# EAGLE design Main (EAGLE 7.2.0)
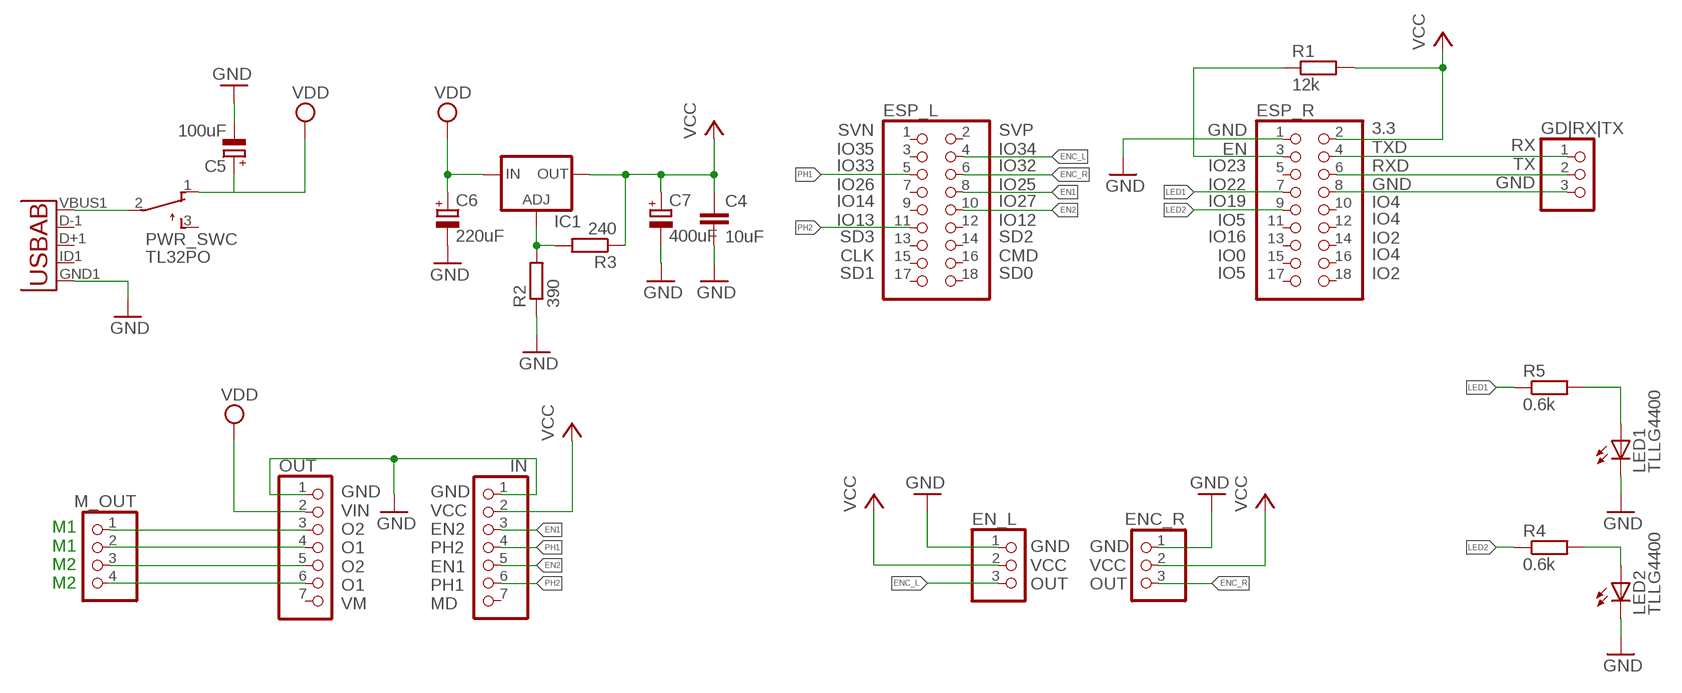
[diagram p0: schematic, sheet 1]

## Parts
C4  10uF  C-EU050-025X075  [C050-025X075]
C5  100uF  CPOL-EUE2.5-6  [E2,5-6]
C6  220uF  CPOL-EUE2.5-6  [E2,5-6]
C7  400uF  CPOL-EUE2.5-6  [E2,5-6]
EN_L  PINHD-1X3  [1X03]
ENC_R  PINHD-1X3  [1X03]
ESP_L  PINHD-2X9  [2X09]
ESP_R  PINHD-2X9  [2X09]
GD|RX|TX  PINHD-1X3  [1X03]
IC1  LM317TS  [317TS]
IN  PINHD-1X7  [1X07]
LED1  TLLG4400  [LED3MM]
LED2  TLLG4400  [LED3MM]
M_OUT  PINHD-1X4  [1X04]
OUT  PINHD-1X7  [1X07]
PWR_SWC  TL32PO  [TL3XPO]
R1  12k  R-EU_0207/10  [0207/10]
R2  390  R-EU_0207/10  [0207/10]
R3  240  R-EU_0207/10  [0207/10]
R4  0.6k  R-EU_0207/10  [0207/10]
R5  0.6k  R-EU_0207/10  [0207/10]
U3  USB""  [USB-MICRO-SMD]

## Nets
EN1: ESP_L.8 IN.3
EN2: ESP_L.10 IN.5
ENC_L: EN_L.3 ESP_L.4
ENC_R: ENC_R.3 ESP_L.6
GND: C4.2 C5.- C6.- C7.- EN_L.1 ENC_R.1 ESP_R.1 IN.1 LED1.K(C) LED2.K(C) OUT.1 R2.1 U3.GND1(GND)
LED1: ESP_R.7 R5.1
LED2: ESP_R.9 R4.1
N$1: M_OUT.1 OUT.3
N$2: M_OUT.2 OUT.4
N$3: M_OUT.3 OUT.5
N$4: M_OUT.4 OUT.6
N$5: ESP_R.4 GD|RX|TX.1
N$6: ESP_R.6 GD|RX|TX.2
N$7: IC1.1(ADJ) R2.2 R3.2
N$8: ESP_R.8 GD|RX|TX.3
N$10: LED2.A R4.2
N$11: PWR_SWC.2(P) U3.VBUS1(VBUS)
N$12: ESP_R.3 R1.1
N$13: LED1.A R5.2
PH1: ESP_L.5 IN.4
PH2: ESP_L.11 IN.6
VCC: C4.1 C7.+ EN_L.2 ENC_R.2 ESP_R.2 IC1.2(OUT) IN.2 R1.2 R3.1
VDD: C5.+ C6.+ IC1.3(IN) OUT.2 PWR_SWC.1(O)
Unconnected: ESP_L.1 ESP_L.2 ESP_L.3 ESP_L.7 ESP_L.9 ESP_L.12 ESP_L.13 ESP_L.14 ESP_L.15 ESP_L.16 ESP_L.17 ESP_L.18 ESP_R.5 ESP_R.10 ESP_R.11 ESP_R.12 ESP_R.13 ESP_R.14 ESP_R.15 ESP_R.16 ESP_R.17 ESP_R.18 IN.7 OUT.7 PWR_SWC.3(S) U3.D+1(D+) U3.D-1(D-) U3.ID1(USBID)

## Notes on the sheet
- SVN
  IO35
- SVP
  IO34
- GND
  EN
- RX
  TX
  GND
- IO33
  IO26
- IO32
  IO25
- IO23
  IO22
- 3.3
  TXD
  RXD
  GND
- IO4
- IO14
  IO13
- IO27
  IO12
- IO19
  IO5
- IO4
  IO2
- SD3
  CLK
- SD2
  CMD
- IO16
  IO0
- SD1 | SD0 | IO5
- IO4
  IO2
- M1
  M1
  M2
  M2
- GND
  VCC
  OUT
- GND
  VCC
  OUT
- GND
  VIN
  O2
  O1
  O2
  O1
  VM
- GND
  VCC
  EN2
  PH2
  EN1
  PH1
  MD

## Library data of the parts
C4 = resistor:C-EU: CAPACITOR, European symbol
C5-C7 = rcl:CPOL-EU: POLARIZED CAPACITOR, European symbol
EN_L ENC_R GD|RX|TX = pinhead:PINHD-1X3: PIN HEADER
ESP_L ESP_R = pinhead:PINHD-2X9: PIN HEADER
IC1 = v-reg:LM317TS: VOLTAGE REGULATOR
IN OUT = pinhead:PINHD-1X7: PIN HEADER
LED1 LED2 = led:TLLG4400: Low Current (2mA) LED 3 mm Tinted Diffused Package color GREEN Source: Data sheet <http://www.farnell.com/datasheets/391098.pdf>; MF: VISHAY SEMICONDUCTOR; OC_FARNELL: 1612435
M_OUT = pinhead:PINHD-1X4: PIN HEADER
PWR_SWC = switch:TL32PO: TINY SWITCH ON - MOM Source: http://www2.produktinfo.conrad.com/datenblaetter/700000-724999/705152-da-01-de-Subminiaturschalter_TL_36YO.pdf
R1-R5 = rcl:R-EU_: RESISTOR, European symbol
U3 = MicroUSB:USB: This is a USB AB connector that is compatible with USB OTG. i.e. this connector can serve as a host or device

## Board
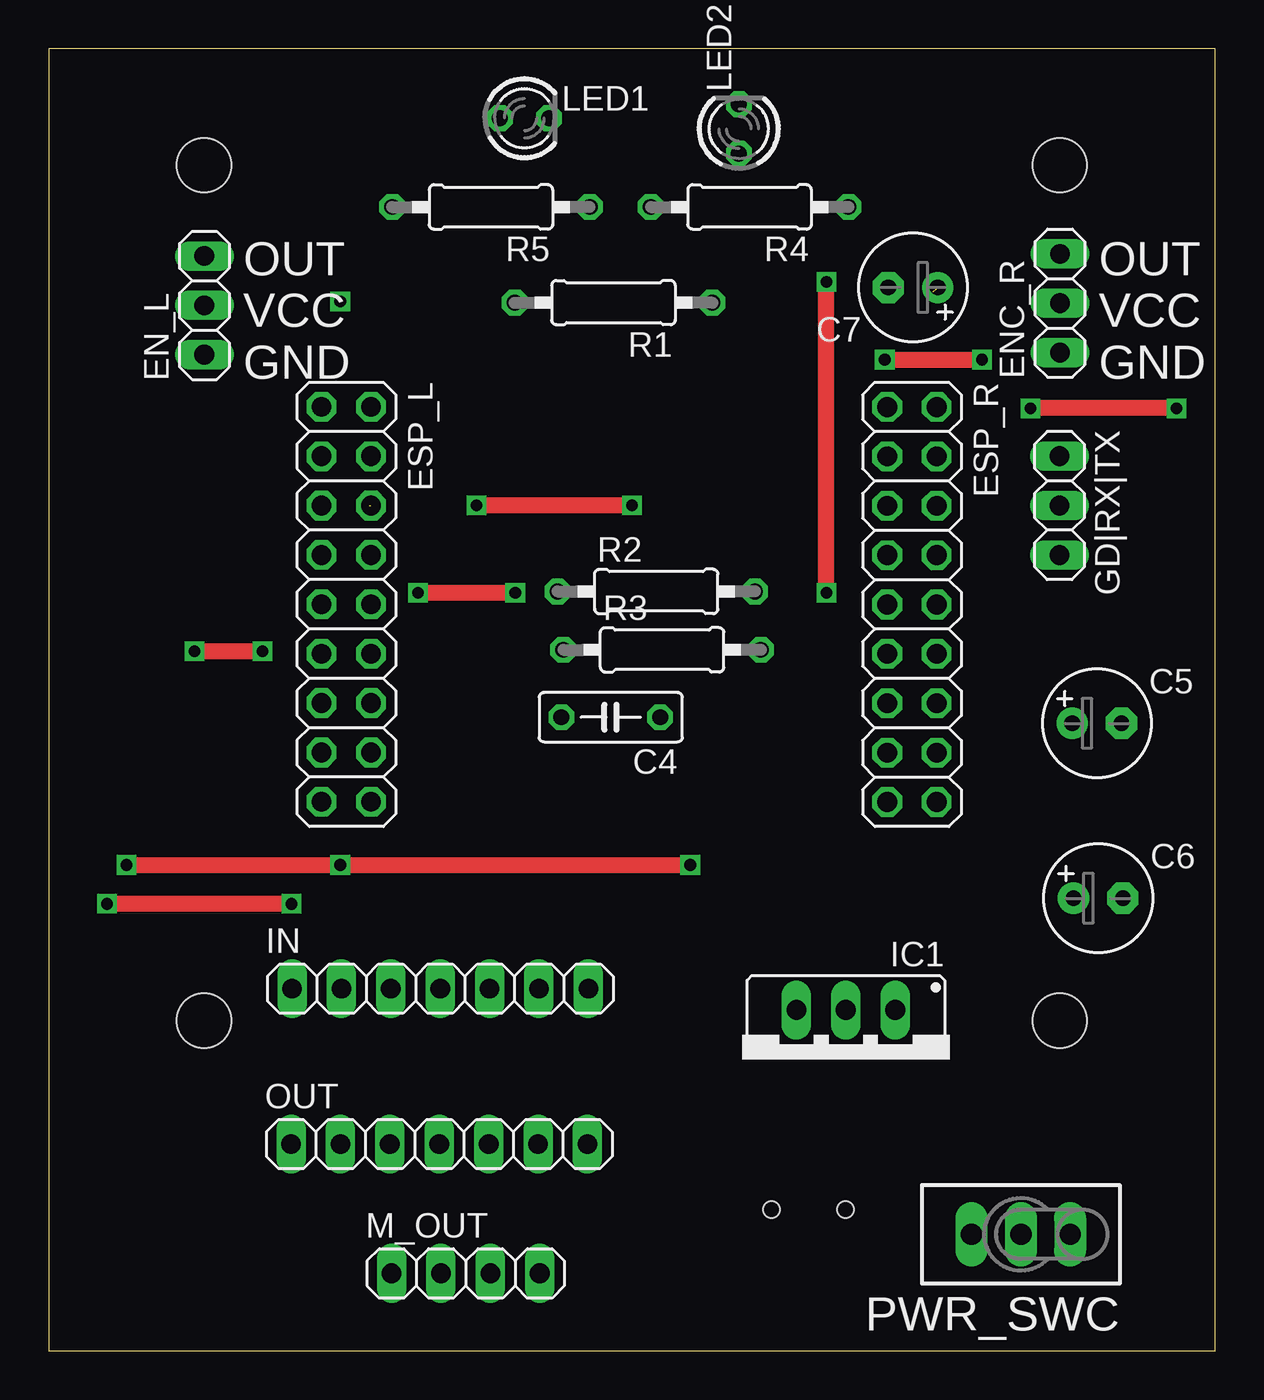
[diagram p1: board, top side]
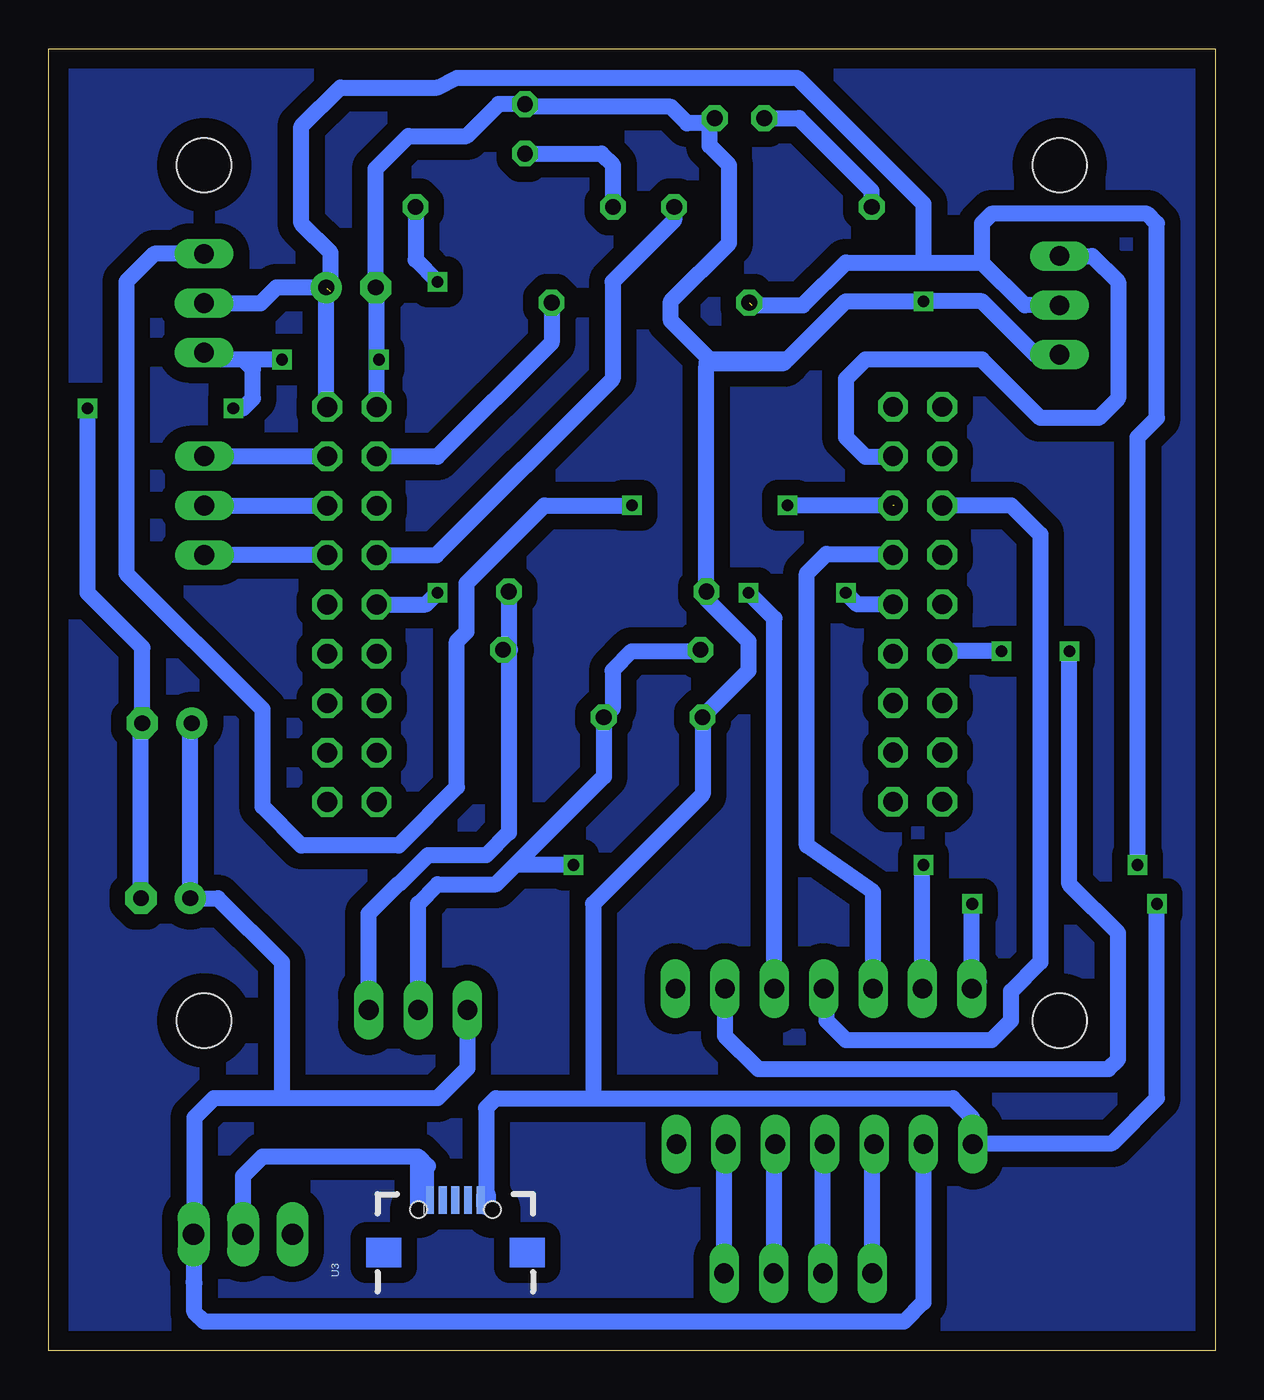
[diagram p2: board, bottom side, seen from below]

Size 60 x 67 mm. Coordinates in mm from the lower left corner, seen from the top.
Outline: 0,0 60,0 60,67 0,67 0,0
Copper layers (1*16): Top 0.035mm / dielectric 1.5mm / Bottom 0.035mm
Design rules "default": minimum track width 10mil, minimum drill 24mil, track to track 8mil, track to pad 8mil, pad to pad 8mil, via to via 8mil, smd to smd 8mil, copper to edge 40mil, drill to drill 8mil, minimum pad ring 10mil, minimum via ring 8mil, stop-mask expansion 4mil, vias tented up to drill 0mil, thermal gap 10mil
Holes 2.8 mm at 8,17 8,61 52,61 52,17

### Footprints (pad centres in the part's own frame; a part is rotated, then mirrored left to right if it is on the bottom)
C050-025X075 = drill 0.813 octagon: 1 -2.54,0; 2 2.54,0
E2,5-6 = drill 0.813 pad 1.6: + -1.27,0 | drill 0.813 pad 1.6 octagon: - 1.27,0
1X03 = drill 1.016 long: 1 -2.54,0; 2 0,0; 3 2.54,0
2X09 = drill 1.016 octagon: 1 -10.16,-1.27; 2 -10.16,1.27; 3 -7.62,-1.27; 4 -7.62,1.27; 5 -5.08,-1.27; 6 -5.08,1.27; 7 -2.54,-1.27; 8 -2.54,1.27; 9 0,-1.27; 10 0,1.27; 11 2.54,-1.27; 12 2.54,1.27; 13 5.08,-1.27; 14 5.08,1.27; 15 7.62,-1.27; 16 7.62,1.27; 17 10.16,-1.27; 18 10.16,1.27
317TS = drill 1.016 long: 1 -2.54,-2.54; 2 0,-2.54; 3 2.54,-2.54
1X07 = drill 1.016 long: 1 -7.62,0; 2 -5.08,0; 3 -2.54,0; 4 0,0; 5 2.54,0; 6 5.08,0; 7 7.62,0
LED3MM = drill 0.813 octagon: A -1.27,0; K 1.27,0
1X04 = drill 1.016 long: 1 -3.81,0; 2 -1.27,0; 3 1.27,0; 4 3.81,0
TL3XPO = drill 1.1 pad 1.422 long: 1 -2.54,0; 2 0,0; 3 2.54,0
0207/10 = drill 0.813 octagon: 1 -5.08,0; 2 5.08,0
USB-MICRO-SMD = smd 1.4 x 0.4: D+1 2.7,0; D-1 2.7,0.65; GND1 2.7,-1.3; ID1 2.7,-0.65; VBUS1 2.7,1.3 | hole 0.85: 2.2,1.9; 2.2,-1.9

### Placement (x,y rotation side)
C4  28.91,32.6 180 top
C5  53.91,32.29 0 top
C6  53.98,23.29 0 top
C7  44.45,54.71 180 top
EN_L  8.01,53.79 90 top
ENC_R  52.01,53.9 90 top
ESP_L  15.31,38.41 270 top
ESP_R  44.4,38.4 270 top
GD|RX|TX  51.99,43.49 270 top
IC1  41,15 180 top
IN  20.14,18.64 0 top
LED1  24.47,63.42 0 top
LED2  35.5,62.87 90 top
M_OUT  21.45,3.99 0 top
OUT  20.09,10.64 0 top
PWR_SWC  50,6 180 top
R1  29.05,53.93 180 top
R2  31.25,39.07 0 top
R3  31.55,36.07 0 top
R4  36.05,58.85 180 top
R5  22.75,58.85 180 top
U3  39.08,5.06 90 bottom

### Tracks (layer width: path | path; a pad name or v marks a point on that pad's centre or on a via)
EN1
  Bottom 0.813: 17.5,18.74 IN.3 17.6,23.6 21,26 21,40 20,41 16.63,41 ESP_L.8
EN2  (via drill 0.6)
  Top 0.813: v24,39 v19,39
  Bottom 0.813: v24,39 22.68,37.68 IN.5 | ESP_L.10 18.41,38.41 v19,39
ENC_L
  Bottom 0.813: EN_L.3 6.33,56.33 5,55 5,49 6,48 9,48 12,51 18,51 19,50 19,47 18,46 16.61,46 ESP_L.4
ENC_R  (via drill 0.6)  (1 unrouted)
  Top 0.813: v30,43.5 v22,43.5
  Bottom 0.813: ENC_R.3 54.56,56.44 56,55 56,40 49,33 49,28 47,26 42,26 39,29 39,36.5 38.5,37 38.5,39.5 34.5,43.5 v30,43.5 | 16.5,43.5 v22,43.5
GND  (via drill 0.6)
  Top 0.813: v43,51 v48,51 | v12.5,23 v3,23 | v58,48.5 v50.5,48.5
  Bottom 0.406: U3.GND1 37.74,7.76 37.5,8
  Bottom 0.813: EN_L.1 9.25,51.25 12,54 v15,54 19,54 22,51 | 32,13 32,23 26.37,28.63 C4.2 26.37,32.63 24,35 24,36.5 26.17,38.67 R2.1 26.17,50.66 26,50.83 | 22,51 26,51 | 26,51 28,53 28,54 25,57 25,61 26,62 26,63.16 | 26,63.16 LED1.K | v43,51 43.13,50.87 ESP_R.1 43.13,54.66 C7.- 43.18,60.82 41.5,62.5 38.5,62.5 36.86,64.14 LED2.K 35.36,64 28,64 27.16,63.16 26,63.16 | v48,51 50,51 | 50,51 51.65,51 ENC_R.1 | 26,51 26.17,50.83 26,50.83 | 26,50.83 22.17,50.83 22,51 | 12.16,19 IN.1 12.52,22.98 v12.5,23 | v3,23 3,13 5.31,10.69 12.52,10.69 OUT.1 12.5,10.67 12.5,12 13.5,13 32,13 | 32,13 37,13 37.5,12.5 37.5,7.5 | C6.- 55.25,32.22 C5.- 55.18,36.18 58,39 v58,48.5 | v50.5,48.5 50,48.5 49.5,49 49.5,50.5 50,51
  Bottom 1.016: 37.5,7.5 37.5,8
LED1
  Bottom 0.813: ESP_R.7 40.06,40.94 31,50 31,55 27.83,58.17 R5.1
LED2  (via drill 0.6)
  Top 0.813: v40,39 v40,55
  Bottom 0.813: R4.1 41.13,56.13 v40,55 | ESP_R.9 40.6,38.4 v40,39
N$1
  Bottom 0.813: M_OUT.1 17.64,10.55 OUT.3
N$2
  Bottom 0.813: M_OUT.2 20.18,10.55 OUT.4
N$3
  Bottom 0.813: OUT.5 22.72,10.55 M_OUT.3
N$4
  Bottom 0.813: M_OUT.4 25.26,10.55 OUT.6
N$5
  Bottom 0.813: GD|RX|TX.1 ESP_R.4
N$6
  Bottom 0.813: GD|RX|TX.2 ESP_R.6
N$7
  Bottom 0.813: IC1.1 43.54,22.5 42.04,24 42,24 40.5,25.5 37.5,25.5 36.33,26.67 36.33,36 | R2.2 36.33,36 | R3.2 36.26,36.07 36.33,36
N$8
  Bottom 0.813: ESP_R.8 GD|RX|TX.3
N$9
  Bottom 0.813: 41,7.5 41,9.5
N$10
  Bottom 0.813: R4.2 30.97,61 31.57,61.6 LED2.A
N$11
  Bottom 0.406: 40.5,9 40.5,7.5 | U3.VBUS1 40.38,9.38 40.5,9.5
  Bottom 0.61: 40.5,7.5 40.5,9.5
  Bottom 0.813: PWR_SWC.2 50,9 49,10 41,10 40.5,9.5
N$12
  Bottom 0.813: R1.1 34.13,51.87 40,46 43.11,46 ESP_R.3
N$13
  Bottom 0.813: LED1.A 21.42,63.42 17.67,59.67 R5.2
N$14
  pour Bottom (isolate 0.813): 0,67 60,67 60,0 0,0
PH1
  Bottom 0.813: IN.4 20,18.5 20,17 19,16 11.5,16 10.5,17 10.5,18.5 9,20 9,42 10.5,43.5 ESP_L.5
PH2  (via drill 0.6)
  Top 0.813: v7.5,36 v11,36
  Bottom 0.813: 25,18.42 IN.6 25.22,16.22 23.5,14.5 5.5,14.5 5,15 5,21.5 7.5,24 v7.5,36 | v11,36 13.91,36 ESP_L.11
VCC  (via drill 0.6)  (2 unrouted)
  Top 0.813: v4,25 v15,25 v33,25
  Bottom 0.813: C7.+ 48.29,54.71 49.1,53.9 ENC_R.2 | 45.67,54.66 C7.+ | EN_L.2 9.79,53.79 12,56 | v4,25 4,47 3,48 3,58 3.5,58.5 11.5,58.5 12,58 12,56 | 23.83,53.79 21.21,53.79 19,56 15,56 | 15,56 12,56 | IC1.2 41,23 40,24 37,24 36,25 | 36,25 31.45,29.55 C4.1 31,33.05 31,35 30,36 26.54,36 R3.1 | 45.67,54.33 45.5,54.5 45.5,56.5 47,58 47,63 45,65 40,65 39,65.5 21.5,65.5 15,59 15,56 | ESP_R.2 45.72,48.56 C7.+ | v33,25 36,25 | IN.2 15.06,24.94 v15,25
VDD
  Bottom 0.813: OUT.2 15.01,2.49 16,1.5 52,1.5 52.5,2 52.5,3.5 52.54,3.54 PWR_SWC.1 52.5,6.04 52.5,12 51.5,13 48,13 | IC1.3 38.46,14.54 40,13 48,13 | 48,13 48,20 51.29,23.29 C6.+ 52.71,32.22 C5.+

### Text on the board
tNames: OUT / VCC / GND | OUT / VCC / GND